# Altium schematic sheet rs232_12V_step_Vadim_list2.SchDoc
size 420 x 297 mm; DocumentNumber: rs232_12V_step Э3; SheetNumber: 2; Format: A3
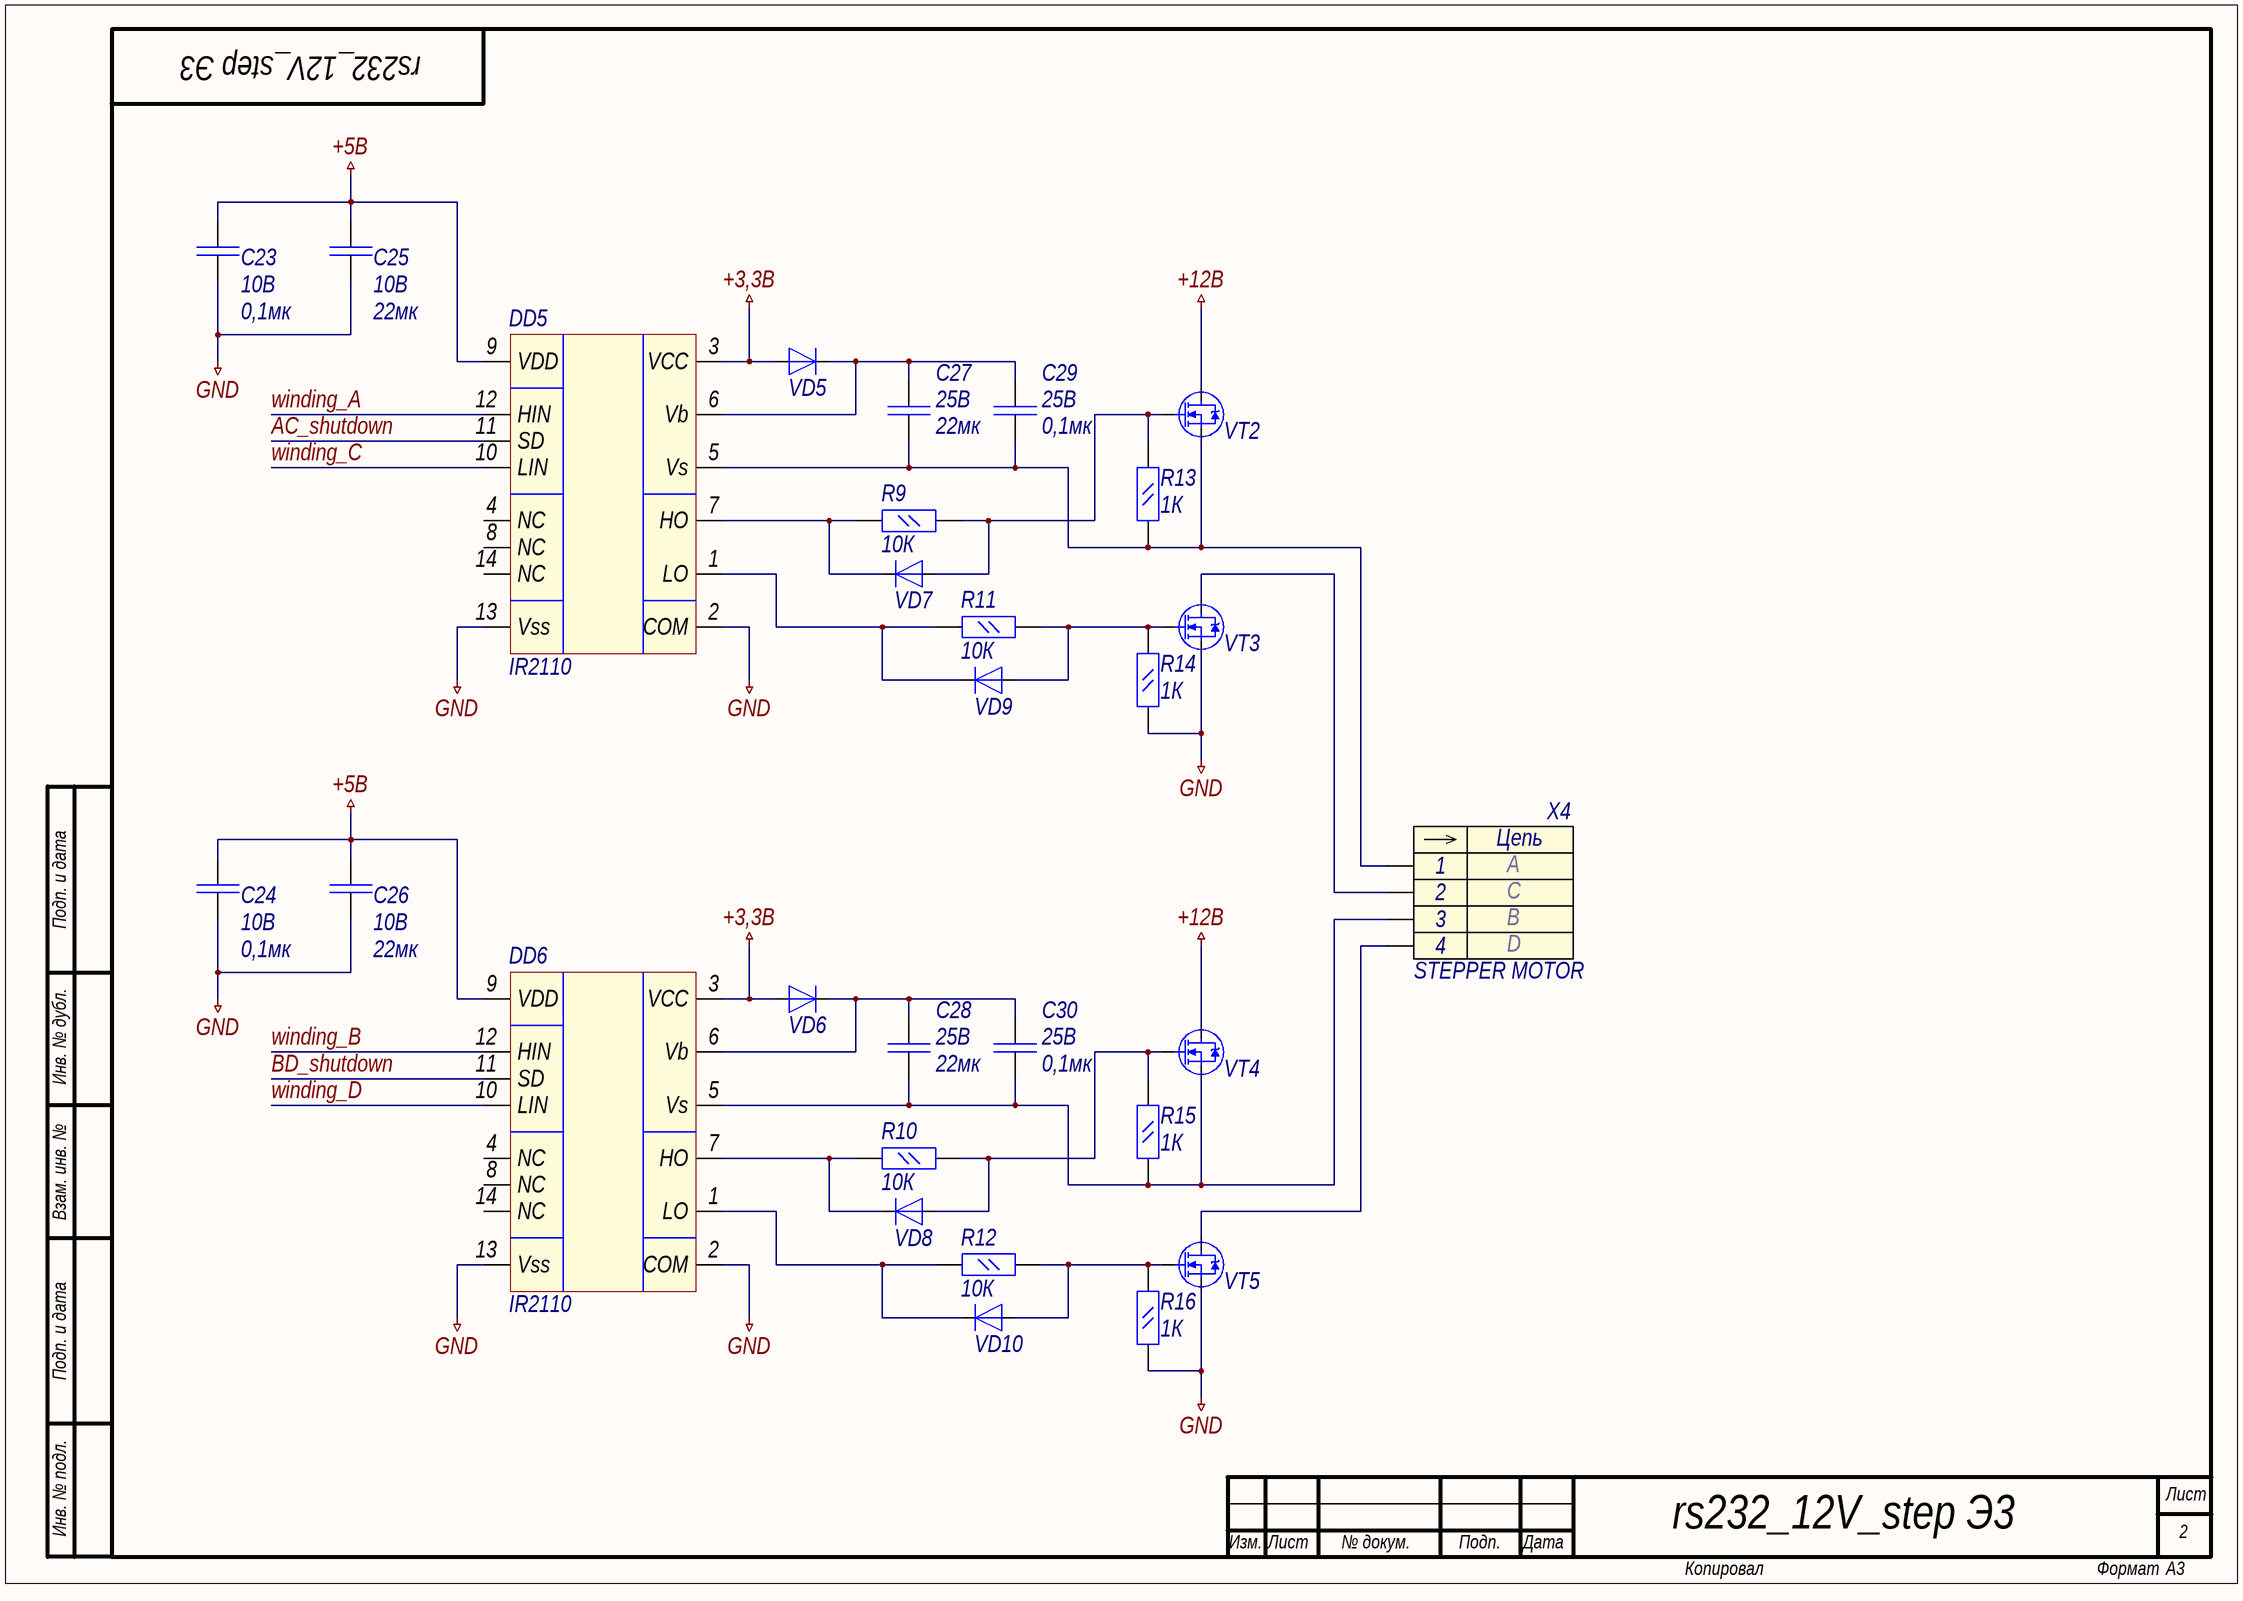
[diagram p0: rs232_12V_step_Vadim_list2.SchDoc]

## Parts
C23  Voltage: 10В  Capacitance: 0,1мк  [CH0402C]  (hidden comment: Capacitor)
C24  Voltage: 10В  Capacitance: 0,1мк  [CH0402C]  (hidden comment: Capacitor)
C25  Voltage: 10В  Capacitance: 22мк  [CH0603C]  (hidden comment: Capacitor)
C26  Voltage: 10В  Capacitance: 22мк  [CH0603C]  (hidden comment: Capacitor)
C27  Voltage: 25В  Capacitance: 22мк  [CH0805C]  (hidden comment: Capacitor)
C28  Voltage: 25В  Capacitance: 22мк  [CH0805C]  (hidden comment: Capacitor)
C29  Voltage: 25В  Capacitance: 0,1мк  [CH0402C]  (hidden comment: Capacitor)
C30  Voltage: 25В  Capacitance: 0,1мк  [CH0402C]  (hidden comment: Capacitor)
DD5  IR2110  [14-DIP]
DD6  IR2110  [14-DIP]
R9  Impedance: 10К  [CH0805R]  (hidden comment: Res_0.125)
R10  Impedance: 10К  [CH0805R]  (hidden comment: Res_0.125)
R11  Impedance: 10К  [CH0805R]  (hidden comment: Res_0.125)
R12  Impedance: 10К  [CH0805R]  (hidden comment: Res_0.125)
R13  Impedance: 1К  [CH0402R]  (hidden comment: Res_0.125)
R14  Impedance: 1К  [CH0402R]  (hidden comment: Res_0.125)
R15  Impedance: 1К  [CH0402R]  (hidden comment: Res_0.125)
R16  Impedance: 1К  [CH0402R]  (hidden comment: Res_0.125)
VD5  Diod  [DO201AD]  (value not drawn)
VD6  Diod  [DO201AD]  (value not drawn)
VD7  Diod  [DO201AD]  (value not drawn)
VD8  Diod  [DO201AD]  (value not drawn)
VD9  Diod  [DO201AD]  (value not drawn)
VD10  Diod  [DO201AD]  (value not drawn)
VT2  N-Channel  [SOT23_132]  (value not drawn)
VT3  N-Channel  [SOT23_132]  (value not drawn)
VT4  N-Channel  [SOT23_132]  (value not drawn)
VT5  N-Channel  [SOT23_132]  (value not drawn)
X4  STEPPER MOTOR  2: C  3: B  1: A  4: D  [CON: CWF-4R]

## Nets
+3,3В: DD5.3(VCC) DD6.3(VCC) VD5.1 VD6.1
+5В: C23.2(C1-) C24.2(C1-) C25.2(C1-) C26.2(C1-) DD5.9(VDD) DD6.9(VDD)
+12В: VT2.2(D) VT4.2(D)
GND: C23.1(C1+) C24.1(C1+) C25.1(C1+) C26.1(C1+) DD5.2(COM) DD5.13(Vss) DD6.2(COM) DD6.13(Vss) R14.2(C1-) R16.2(C1-) VT3.3(S) VT5.3(S)
AC_shutdown: DD5.11(SD)
BD_shutdown: DD6.11(SD)
winding_A: DD5.12(HIN)
winding_B: DD6.12(HIN)
winding_C: DD5.10(LIN)
winding_D: DD6.10(LIN)
NetC27_1: C27.1(C1+) C29.1(C1+) DD5.5(Vs) R13.2(C1-) VT2.3(S) X4.1
NetC27_2: C27.2(C1-) C29.2(C1-) DD5.6(Vb) VD5.2
NetC28_1: C28.1(C1+) C30.1(C1+) DD6.5(Vs) R15.2(C1-) VT4.3(S) X4.3
NetC28_2: C28.2(C1-) C30.2(C1-) DD6.6(Vb) VD6.2
NetDD5_1: DD5.1(LO) R11.1(C1-) VD9.2
NetDD5_7: DD5.7(HO) R9.1(C1-) VD7.2
NetDD6_1: DD6.1(LO) R12.1(C1-) VD10.2
NetDD6_7: DD6.7(HO) R10.1(C1-) VD8.2
NetR9_2: R9.2(C1-) R13.1(C1-) VD7.1 VT2.1(G)
NetR10_2: R10.2(C1-) R15.1(C1-) VD8.1 VT4.1(G)
NetR11_2: R11.2(C1-) R14.1(C1-) VD9.1 VT3.1(G)
NetR12_2: R12.2(C1-) R16.1(C1-) VD10.1 VT5.1(G)
NetVT3_2: VT3.2(D) X4.2
NetVT5_2: VT5.2(D) X4.4

Not connected (* = marked no-connect by the designer): DD5 4(NC) 8(NC) 14(NC); DD6 4(NC) 8(NC) 14(NC)

## Notes on the sheet
- Подп. и дата
- Инв. № дубл.
- Взам. инв. №
- Инв. № подл.
- Лист
- Изм.
- № докум.
- Подп.
- Дата
- Копировал
- Формат
- (in symbol 4_pins) Цепь

## Library data of the parts
C23 C24 = Capacitor: Manufacture: AVX; Model: 0402ZD103KAT2A; Case: 0402; HelpURL: https://ru.mouser.com/ProductDetail/AVX/0402ZD103KAT2A?qs=sGAEpiMZZMs0AnBnWHyRQKdiqyDPVQdAu74W%2fwwRq8A%3d
C25 C26 = Capacitor: Manufacture: Samsung Electro-Mechanics; Model: CL10A226MPCNUBE; Case: 0603; HelpURL: https://www.digikey.com/product-detail/en/samsung-electro-mechanics/CL10A226MPCNUBE/1276-6504-2-ND/5960988
C27 C28 = Capacitor: Manufacture: Murata Electronics North America; Model: GRM21BR61E226ME44K; Case: 0805; HelpURL: https://www.digikey.com/product-detail/en/murata-electronics-north-america/GRM21BR61E226ME44K/490-14661-2-ND/4905534
C29 C30 = Capacitor: Manufacture: Samsung Electro-Mechanics; Model: CL05B103KA5NNND; Case: 0402; HelpURL: https://www.digikey.com/product-detail/en/samsung-electro-mechanics/CL05B103KA5NNND/CL05B103KA5NNND-ND/3894196
DD5 DD6 = IR2110: Manufacture: Infineon Technologies; Model: IR2110; HelpURL: https://www.digikey.com/product-detail/en/infineon-technologies/IR2110/IR2110-ND/296047; Case: 14-Lead PDIP
R9-R12 = Res_0.125: Manufacture: Panasonic Industrial Devices; Model: ERJ-6ENF9091V; Case: 0805; HelpURL: https://ru.mouser.com/ProductDetail/Panasonic-Industrial-Devices/ERJ-6ENF9091V?qs=sGAEpiMZZMvdGkrng054tx7%2f6%252bNA3LAJZkxjwUnWjWM%3d
R13-R16 = Res_0.125: Manufacture: KOA Speer; Model: SG73P1ETTP1001F; Case: 0402; HelpURL: https://ru.mouser.com/ProductDetail/KOA-Speer/SG73P1ETTP1001F?qs=sGAEpiMZZMvdGkrng054t%2f16WM9J8YovCYtiWkW5%2faA%3d
VD5-VD10 = Diod: Manufacture: SMC Diode Solutions; Model: UF4007TA; U_thr: 1кВ; HelpURL: https://www.digikey.com/product-detail/en/smc-diode-solutions/UF4007TA/1655-1692-3-ND/6022782
VT2-VT5 = N-Channel: Manufacture: Diodes Incorporated; U_gs: 300мВ; Model: DMG2301LK-7; U_sd: 20В; I_d: 2,4А; HelpURL: https://ru.mouser.com/ProductDetail/Diodes-Incorporated/DMG2301LK-7?qs=sGAEpiMZZMshyDBzk1%2fWi3VK%2fMVeCy7TGgocA8mg7FfG8rajAhy0Kw%3d%3d; Case: SOT_23
X4 = 4_pins: Bipolar Stepper Motor 200 Step 0.35A 12VDC; Manufacture: Adafruit Industries LLC; ManufactureConnector: Omron Electronics; Model: 324; ModelConnector: XN2D-4471; HelpURL: https://www.digikey.com/product-detail/en/adafruit-industries-llc/324/1528-1062-ND/5022791; Case: Square - 1.654" x 1.654" (42.00mm x 42.00mm); CaseConnector: *; HelpURLConnector: https://ru.mouser.com/ProductDetail/Omron-Electronics/XN2D-4471?qs=sGAEpiMZZMvd2mIcYG7oaC0TeQEBnk0JvHtcE4UuDS0%3D